# Altium schematic sheet mcu.SchDoc
size A4
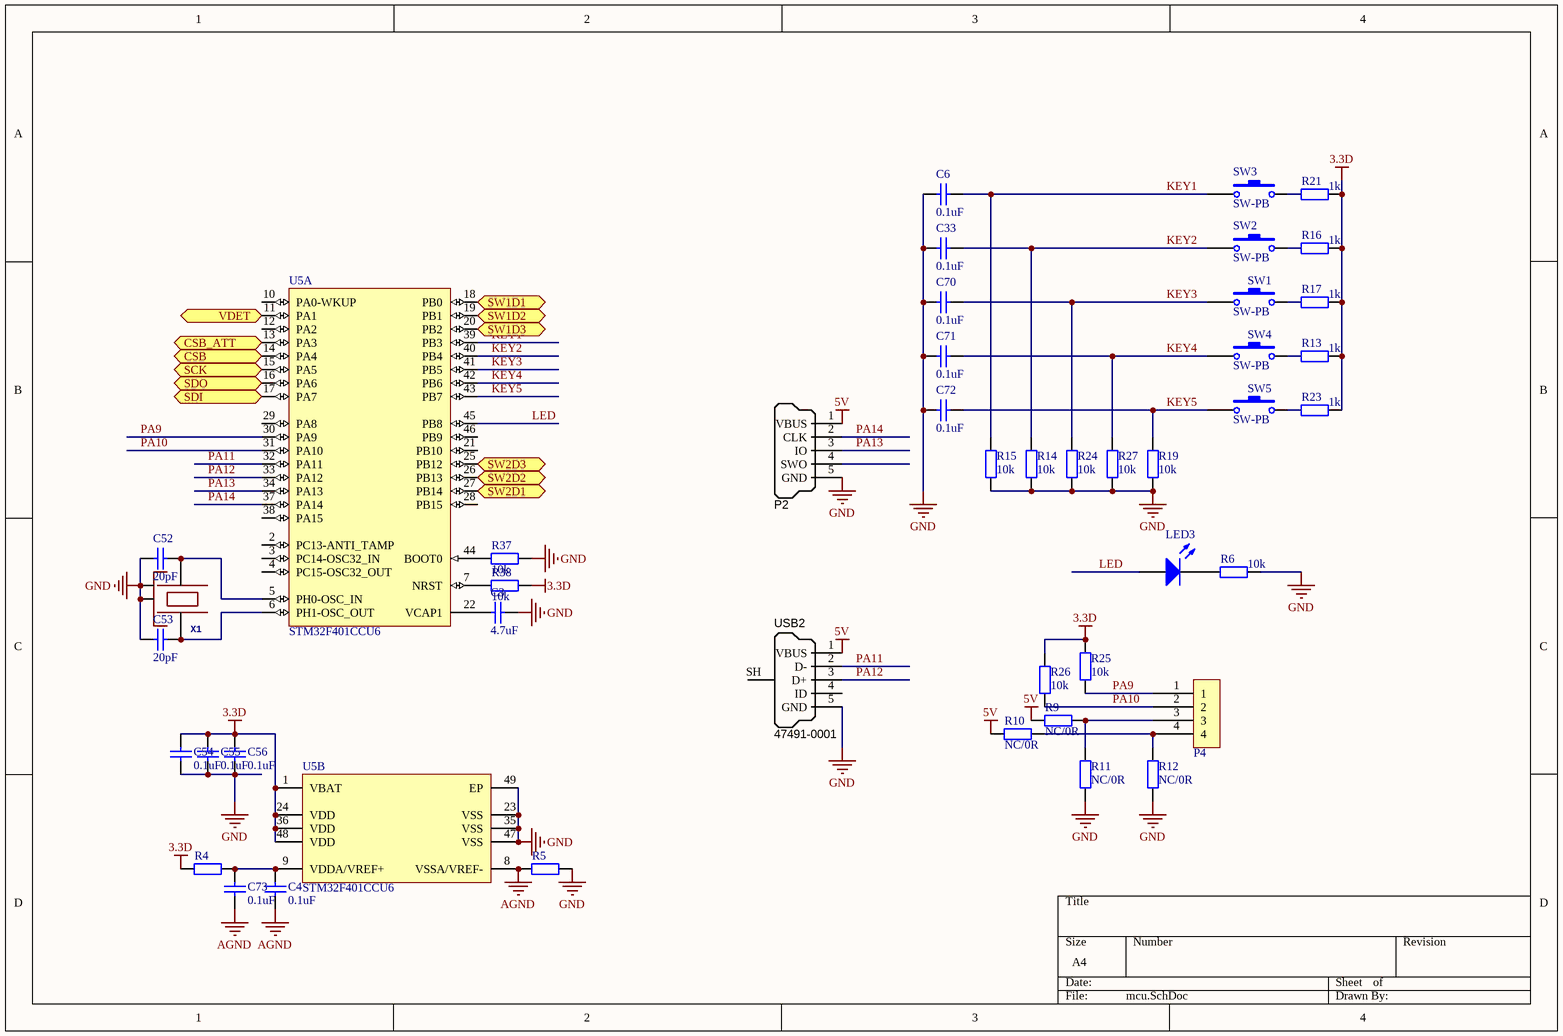
[diagram p0: mcu.SchDoc]

## Parts
C3  value 4.7uF  [0603]  (hidden comment: Cap)
C4  value 0.1uF  [0402]  (hidden comment: Cap)
C6  value 0.1uF  [0402]  (hidden comment: Cap)
C33  value 0.1uF  [0402]  (hidden comment: Cap)
C52  value 20pF  [0402]  (hidden comment: Cap)
C53  value 20pF  [0402]  (hidden comment: Cap)
C54  value 0.1uF  [0402]  (hidden comment: Cap)
C55  value 0.1uF  [0402]  (hidden comment: Cap)
C56  value 0.1uF  [0402]  (hidden comment: Cap)
C70  value 0.1uF  [0402]  (hidden comment: Cap)
C71  value 0.1uF  [0402]  (hidden comment: Cap)
C72  value 0.1uF  [0402]  (hidden comment: Cap)
C73  value 0.1uF  [0402]  (hidden comment: Cap)
LED3  LED0  [0603]  (value not drawn)
P2  SWD_MicroUSB  [MICRO-YZX]  (value not drawn)
P4  UART/I2C  [4pSocket]  (value not drawn)
R4  0R/FB  [0402]  (value not drawn)
R5  0R/FB  [0402]  (value not drawn)
R6  10k  [0402]
R9  NC/0R  [0402]
R10  NC/0R  [0402]
R11  NC/0R  [0402]
R12  NC/0R  [0402]
R13  1k  [0402]
R14  10k  [0402]
R15  10k  [0402]
R16  1k  [0402]
R17  1k  [0402]
R19  10k  [0402]
R21  1k  [0402]
R23  1k  [0402]
R24  10k  [0402]
R25  10k  [0402]
R26  10k  [0402]
R27  10k  [0402]
R37  value 10k  [0402]  (hidden comment: Res2)
R38  value 10k  [0402]  (hidden comment: Res2)
SW1  SW-PB  [SW3x4]
SW2  SW-PB  [SW3x4]
SW3  SW-PB  [SW3x4]
SW4  SW-PB  [SW3x4]
SW5  SW-PB  [SW3x4]
U5  STM32F401CCU6  [STM-UFQFPN48_N]  (parts A,B of 2)
USB2  Manufacturer Part Number 1: 47491-0001  [MICRO-YZX]  (hidden comment: USB Micro Type B)
X1  24.000 KHz 3.2x2.5mm 8-10pf  [OSCILLATOR-3.2X2.5]  (value not drawn)

## Ports
CSB, CSB_ATT, SCK, SDI, SDO, SW1D1, SW1D2, SW1D3, SW2D1, SW2D2, SW2D3, VDET

## Nets
3.3D: C54.2 C55.2 C56.2 R4.2 R13.2 R16.2 R17.2 R21.2 R23.2 R25.2 R26.2 R38.1 U5.1(VBAT) U5.24(VDD) U5.36(VDD) U5.48(VDD)
5V: P2.1(VBUS) R9.2 R10.2 USB2.1(VBUS)
AGND: C4.1 C73.1 R5.2 U5.8(VSSA/VREF-)
GND: C3.1 C6.1 C33.2 C52.1 C53.1 C54.1 C55.1 C56.1 C70.2 C71.2 C72.2 P2.5(GND) R5.1 R6.2 R11.1 R12.1 R14.1 R15.1 R19.1 R24.1 R27.1 R37.2 U5.23(VSS) U5.35(VSS) U5.47(VSS) U5.49(EP) USB2.5(GND) X1.2(NC_2) X1.4(NC_4)
CSB: U5.14(PA4) ; port CSB
CSB_ATT: U5.13(PA3) ; port CSB_ATT
KEY1: C6.2 R15.2 SW3.1 U5.39(PB3)
KEY2: C33.1 R14.2 SW2.1 U5.40(PB4)
KEY3: C70.1 R24.2 SW1.1 U5.41(PB5)
KEY4: C71.1 R27.2 SW4.1 U5.42(PB6)
KEY5: C72.1 R19.2 SW5.1 U5.43(PB7)
LED: LED3.1(A) U5.45(PB8)
PA9: P4.1 R25.1 U5.30(PA9)
PA10: P4.2 R26.1 U5.31(PA10)
PA11: U5.32(PA11) USB2.2(D-)
PA12: U5.33(PA12) USB2.3(D+)
PA13: P2.3(IO) U5.34(PA13)
PA14: P2.2(CLK) U5.37(PA14)
SCK: U5.15(PA5) ; port SCK
SDI: U5.17(PA7) ; port SDI
SDO: U5.16(PA6) ; port SDO
SW1D1: U5.18(PB0) ; port SW1D1
SW1D2: U5.19(PB1) ; port SW1D2
SW1D3: U5.20(PB2) ; port SW1D3
SW2D1: U5.27(PB14) ; port SW2D1
SW2D2: U5.26(PB13) ; port SW2D2
SW2D3: U5.25(PB12) ; port SW2D3
VDET: U5.11(PA1) ; port VDET
NetC3_2: C3.2 U5.22(VCAP1)
NetC4_2: C4.2 C73.2 R4.1 U5.9(VDDA/VREF+)
NetC52_2: C52.2 U5.5(PH0-OSC_IN) X1.1
NetC53_2: C53.2 U5.6(PH1-OSC_OUT) X1.3
NetLED3_2: LED3.2(K) R6.1
NetP4_3: P4.3 R9.1 R11.2
NetP4_4: P4.4 R10.1 R12.2
NetR13_1: R13.1 SW4.2
NetR16_1: R16.1 SW2.2
NetR17_1: R17.1 SW1.2
NetR21_1: R21.1 SW3.2
NetR23_1: R23.1 SW5.2
NetR37_1: R37.1 U5.44(BOOT0)
NetR38_2: R38.2 U5.7(NRST)

Not connected (* = marked no-connect by the designer): P2 4(SWO); U5 2(PC13-ANTI_TAMP) 3(PC14-OSC32_IN) 4(PC15-OSC32_OUT) 10(PA0-WKUP) 12(PA2) 21(PB10) 28(PB15) 29(PA8) 38(PA15) 46(PB9); USB2 4(ID) SH(Shell)

## Library data of the parts
C3 C4 C6 C33 C52-C56 C70-C73 = Cap: Capacitor; Published: 8-Jun-2000; LatestRevisionDate: 17-Jul-2002; LatestRevisionNote: Re-released for DXP Platform.; PackageReference: RAD-0.3; Publisher: Altium Limited; PackageDescription: Radial Cap, Thru-Hole; 2 Leads; 0.3 in Pin Spacing
LED3 = LED0: Typical INFRARED GaAs LED; Published: 8-Jun-2000; LatestRevisionDate: 08-Jul-2005; LatestRevisionNote: Mech Layer 1 removed.; PackageReference: LED-0; Publisher: Altium Limited; PackageDescription: LED; 2 Leads
P2 = SWD_MicroUSB: Connector SMD USB Micro Type B middle mount; Manufacturer 1: Molex Inc; SCDType: undef; Package / Case: SMD; Supplier 1: Digi-Key; Supplier Part Number 1: WM17142CT-ND
P4 = 4PSocket
R4 R5 R37 R38 = Res2: Resistor; Published: 8-Jun-2000; LatestRevisionDate: 17-Jul-2002; LatestRevisionNote: Re-released for DXP Platform.; PackageReference: AXIAL-0.4; Publisher: Altium Limited; PackageDescription: Axial Device, Thru-Hole; 2 Leads; 0.4 in Pin Spacing
R6 R9-R17 R19 R21 R23-R27 = Res2: Resistor; Value: 0Ohm; Published: 8-Jun-2000; LatestRevisionDate: 17-Jul-2002; LatestRevisionNote: Re-released for DXP Platform.; PackageReference: AXIAL-0.4; Publisher: Altium Limited; PackageDescription: Axial Device, Thru-Hole; 2 Leads; 0.4 in Pin Spacing
SW1-SW5 = SW-PB: Switch; Published: 24-Mar-1999; LatestRevisionDate: 17-Jul-2002; LatestRevisionNote: Re-released for DXP Platform.; PackageReference: SPST-2; Publisher: Altium Limited; PackageDescription: Switch; 2 Leads
U5 = STM32F401CCU6: ARM Cortex-M4 32-bit MCU+FPU, 105 DMIPS, 256 kB Flash, 64 kB Internal RAM, 36 I/Os, 48-pin UFQFPN, -40 to 85 degC, Tray; Manufacturer: STMicroelectronics; FLASH Size (Prog) (kB): 256; I/Os (High Current): 36; Internal RAM Size (kB): 64; Operating Frequency(F) (Processor speed) (MHz): 84; Supply Voltage(Vcc) max (V): 3.6; Supply Voltage(Vcc) min (V): 1.8; DatasheetVersion: Rev. 1; PackageVersion: Rev. 1, 04/2013; PackageReference: UFQFPN48; PackageDescription: 48-Pin Ultra Thin Fine Pitch Quad Flat No-Lead, 7 x 7 x 0.6 mm Body, 0.5 mm Pitch, Exposed Pad; Supplier 1: Newark; Supplier Part Number 1: 19X6217; Supplier 2: Mouser; Supplier Part Number 2: 511-STM32F401CCU6; Core: ARM Cortex-M4; Packing: Tray; Mounting Technology: Surface Mount; PartNumber: STM32F401CCU6; ComponentLink1Description: Manufacturer URL; ComponentLink1URL: http://www.st.com/web/en/home.html; ComponentLink2Description: Datasheet; ComponentLink2URL: http://www.st.com/st-web-ui/static/active/en/resource/technical/document/data_brief/DM00071938.pdf; ComponentLink3Description: Package Specification; ComponentLink3URL: http://www.st.com/st-web-ui/static/active/en/resource/technical/document/data_brief/DM00071938.pdf
USB2 = USB_Micro_TypeB: Connector SMD USB Micro Type B middle mount; Manufacturer 1: Molex Inc; SCDType: undef; Package / Case: SMD; Supplier 1: Digi-Key; Supplier Part Number 1: WM17142CT-ND
X1 = OSCILLATOR-3.2X2.5: Crystal Oscillator in 3.2x2.5 SMD